# EAGLE design max7219-dotmatrix (EAGLE 6.1)
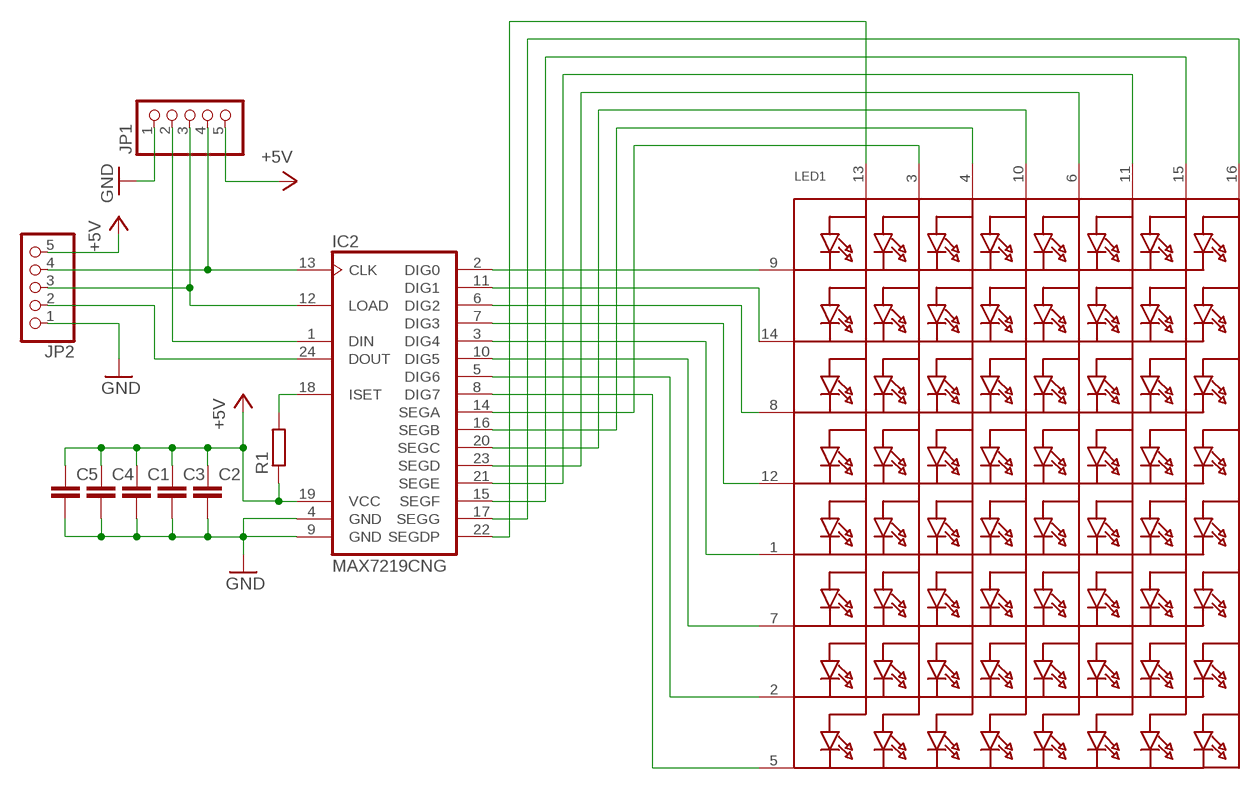
[diagram p0: schematic, sheet 1]

## Parts
C1  C-EUC0805K  [C0805K]
C2  C-EUC0805K  [C0805K]
C3  C-EUC0805K  [C0805K]
C4  C-EUC0805K  [C0805K]
C5  C-EUC0805K  [C0805K]
IC2  MAX7219CNG  [DIL24-3]
JP1  PINHD-1X5/90  [1X05/90]
JP2  PINHD-1X5/90  [1X05/90]
LED1  SEGMENT_8X8_ROWCATHODEM12A881UR  [SEGMENT_BL-M12A881UR]
R1  R-EU_M0805  [M0805]

## Nets
+5V: C1.1 C2.1 C3.1 C4.1 C5.1 IC2.19(VCC) JP1.5 JP2.5 R1.1
GND: C1.2 C2.2 C3.2 C4.2 C5.2 IC2.4(GND) IC2.9(GND) JP1.1 JP2.1
N$17: IC2.2(DIG0) LED1.9(K1)
N$18: IC2.11(DIG1) LED1.14(K2)
N$19: IC2.6(DIG2) LED1.8(K3)
N$20: IC2.7(DIG3) LED1.12(K4)
N$21: IC2.3(DIG4) LED1.1(K5)
N$22: IC2.10(DIG5) LED1.7(K6)
N$23: IC2.5(DIG6) LED1.2(K7)
N$24: IC2.8(DIG7) LED1.5(K8)
N$25: IC2.14(SEGA) LED1.3(A2)
N$26: IC2.16(SEGB) LED1.4(A3)
N$27: IC2.20(SEGC) LED1.10(A4)
N$28: IC2.23(SEGD) LED1.6(A5)
N$29: IC2.21(SEGE) LED1.11(A6)
N$30: IC2.15(SEGF) LED1.15(A7)
N$31: IC2.17(SEGG) LED1.16(A8)
N$32: IC2.22(SEGDP) LED1.13(A1)
N$33: IC2.24(DOUT) JP2.2
N$36: IC2.13(CLK) JP1.4 JP2.4
N$37: IC2.12(LOAD) JP1.3 JP2.3
N$40: IC2.18(ISET) R1.2
N$42: IC2.1(DIN) JP1.2

## Library data of the parts
C1-C5 = rcl:C-EU: CAPACITOR, European symbol
IC2 = maxim:MAX7219CNG: LED DISPLAY DRIVER; MF: MAXIM; MPN: MAX7219CNG; OC_FARNELL: 1523914; OC_NEWARK: 34C4018
JP1 JP2 = pinhead:PINHD-1X5: PIN HEADER
LED1 = adafruit:SEGMENT_8X8_ROWCATHODE: 8x8 LED Segment Displays: Row = Cathode 0.7" Red 8X8 Matrix, 1.9mm Round LEDs - BL-M07C881UR 1.2" Red 8x8 Matrix, 3.0mm Round LEDs - BL-M12A881UR 1.2" Red 8x8 Matrix, 3.0mm Square LEDs - BL-M12A883
R1 = rcl:R-EU_: RESISTOR, European symbol

## Board
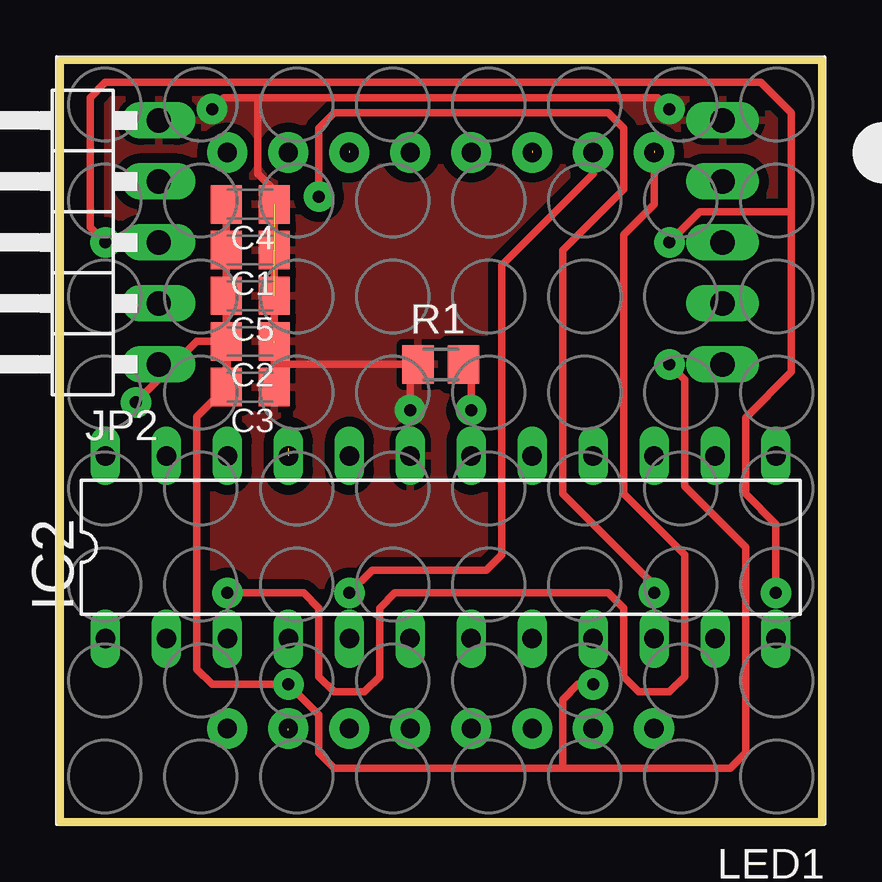
[diagram p1: board, top side]
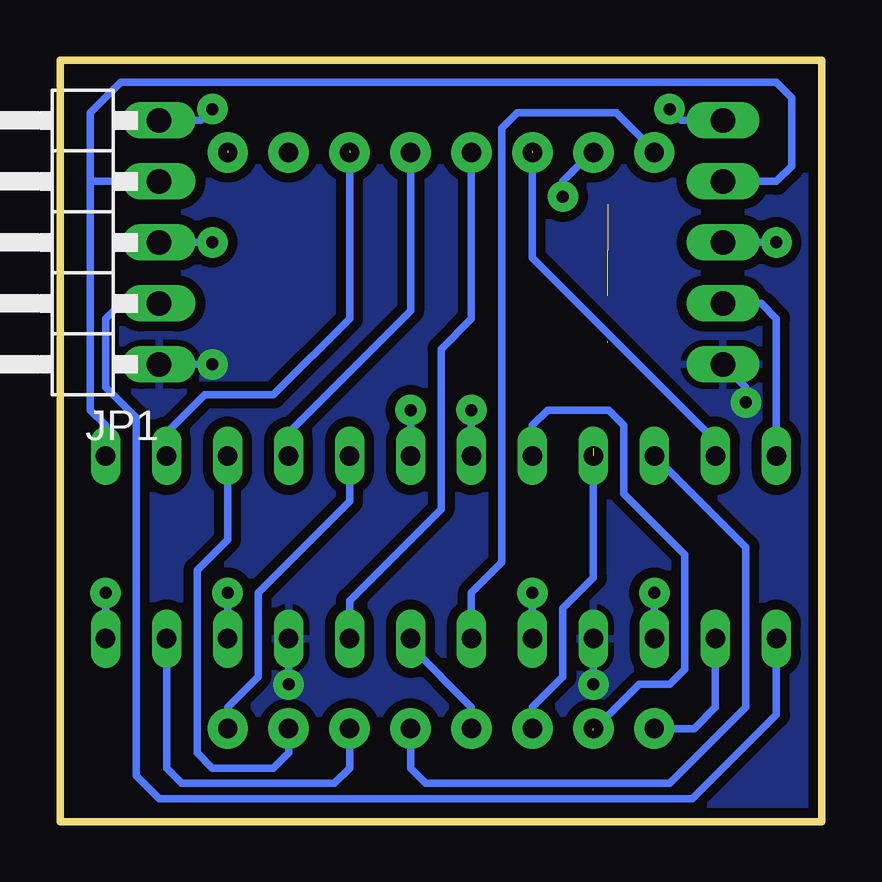
[diagram p2: board, bottom side, seen from below]

Size 31.74 x 31.73 mm. Coordinates in mm from the lower left corner, seen from the top.
Outline: 31.74,0 31.74,31.73 0,31.73 0,0 31.74,0
Copper layers (1*16): Top 0.0356mm / dielectric 1.5011mm / Bottom 0.0356mm
Design rules: minimum track width 6mil, minimum drill 13mil, track to track 6mil, track to pad 6mil, pad to pad 6mil, via to via 6mil, smd to smd 6mil, copper to edge 15mil, drill to drill 6mil, minimum pad ring 7mil, minimum via ring 7mil, stop-mask expansion 3mil, vias tented up to drill 0mil, thermal gap 10mil

### Footprints (pad centres in the part's own frame; a part is rotated, then mirrored left to right if it is on the bottom)
C0805K = smd 1.3 x 1.6: 1 -1,0; 2 1,0
DIL24-3 = drill 0.813 long: 1 -13.97,-3.81; 2 -11.43,-3.81; 3 -8.89,-3.81; 4 -6.35,-3.81; 5 -3.81,-3.81; 6 -1.27,-3.81; 7 1.27,-3.81; 8 3.81,-3.81; 9 6.35,-3.81; 10 8.89,-3.81; 11 11.43,-3.81; 12 13.97,-3.81; 13 13.97,3.81; 14 11.43,3.81; 15 8.89,3.81; 16 6.35,3.81; 17 3.81,3.81; 18 1.27,3.81; 19 -1.27,3.81; 20 -3.81,3.81; 21 -6.35,3.81; 22 -8.89,3.81; 23 -11.43,3.81; 24 -13.97,3.81
1X05/90 = drill 1.016 long: 1 -5.08,-3.81; 2 -2.54,-3.81; 3 0,-3.81; 4 2.54,-3.81; 5 5.08,-3.81
SEGMENT_BL-M12A881UR = drill 0.8 pad 1.676: 1 -8.89,-12; 2 -6.35,-12; 3 -3.81,-12; 4 -1.27,-12; 5 1.27,-12; 6 3.81,-12; 7 6.35,-12; 8 8.89,-12; 9 8.89,12; 10 6.35,12; 11 3.81,12; 12 1.27,12; 13 -1.27,12; 14 -3.81,12; 15 -6.35,12; 16 -8.89,12
M0805 = smd 1.3 x 1.6: 1 -0.95,0; 2 0.95,0

### Placement (x,y rotation side)
C1  7.92,23.81 180 top
C2  7.92,20 180 top
C3  7.92,18.1 180 top
C4  7.92,25.72 180 top
C5  7.92,21.91 180 top
IC2  15.86,11.43 0 top
JP1  31.42,24.13 90 bottom
JP2  0.3,24.13 90 top
LED1  15.86,15.88 180 top
R1  15.86,19.05 0 top

### Tracks (layer width: path | path; a pad name or v marks a point on that pad's centre or on a via)
+5V  (via drill 0.5 pad 1.27)  (3 unrouted)
  Top 0.305: 8.24,30.16 8.24,26.99 8.92,26.3 C4.1 C2.1 | 8.24,30.16 6.81,30.16 v6.34,29.69 | C3.1 8.92,19.05 | 8.92,19.05 8.92,19.95 8.88,20 | 14.59,19.05 8.92,19.05 | R1.1 14.59,19.05 | 14.59,19.05 v14.59,17.14 | 8.24,30.16 24.91,30.16 v25.39,29.69
  Bottom 0.305: v6.34,29.69 5.86,29.21 JP2.5 | v14.59,17.14 IC2.19 | v25.39,29.69 25.86,29.21 JP1.5
  pour Top (isolate 0.406): -0.01,31.75 31.74,31.75 31.74,-3.97 -0.01,-3.81
GND  (via drill 0.5 pad 1.27)
  Top 0.305: 20.94,2.22 27.93,2.22 28.56,2.86 28.56,11.43 26.02,13.97 26.02,18.41 v25.39,19.05 | C4.2 C1.2 | C2.2 C5.2 C1.2 | C2.2 6.97,20 6.97,18.1 | C1.2 C3.2 5.7,16.88 5.7,6.35 6.34,5.71 v9.51,5.71 10.78,4.45 10.78,2.86 11.42,2.22 20.94,2.22 | v3.16,17.46 5.7,20 C2.2 | v22.21,5.71 21.58,5.71 20.94,5.08 20.94,2.22
  Bottom 0.305: v3.16,17.46 3.16,18.1 JP2.1 | v22.21,5.71 IC2.9 | v25.39,19.05 JP1.1 | IC2.4 v9.51,5.71
  pour Bottom (isolate 0.406): -0.01,-6.99 -0.01,31.75 31.74,31.75 31.74,-6.99
N$17
  Bottom 0.305: LED1.9 5.32,3.88 4.43,4.76 IC2.2
N$18
  Bottom 0.305: LED1.14 19.67,2.22 20.31,1.59 26.66,1.59 27.29,2.22 IC2.11
N$19
  Bottom 0.305: IC2.6 14.59,9.53 13.32,10.79 13.32,28.89 12.69,29.53 8.56,29.53 6.97,27.94 LED1.8
N$20
  Bottom 0.305: LED1.12 14.59,4.76 17.13,7.3 IC2.7
N$21  (via drill 0.5 pad 1.27)  (1 unrouted)
  Top 0.305: 24.75,27.94 24.75,25.72 23.48,24.45 23.48,13.65 26.02,11.11 26.02,6.03 25.39,5.4 24.12,5.4 23.48,6.03 23.48,8.89 22.85,9.53 13.96,9.53 13.32,8.89 13.32,6.03 12.69,5.4 11.42,5.4 10.78,6.03 10.78,8.89 10.15,9.53 v6.97,9.53
  Bottom 0.305: v6.97,9.53 IC2.3
N$22  (via drill 0.5 pad 1.27)
  Top 0.305: v24.75,9.53 24.75,9.84 20.94,13.65 20.94,23.81 23.48,26.35 23.48,28.89 22.85,29.53 11.42,29.53 10.78,28.89 v10.78,26.04
  Bottom 0.305: v24.75,9.53 IC2.10 | v10.78,26.04 10.78,26.67 9.51,27.94 LED1.7
N$23  (via drill 0.5 pad 1.27)
  Top 0.305: LED1.2 22.21,26.99 18.4,23.18 18.4,11.11 17.77,10.48 13.01,10.48 v12.05,9.53
  Bottom 0.305: v12.05,9.53 IC2.5
N$24
  Bottom 0.305: LED1.5 14.59,20.95 15.86,19.68 15.86,13.02 19.67,9.21 IC2.8
N$25  (1 unrouted)
  Bottom 0.305: IC2.14 27.29,16.19 25.7,17.78 22.85,17.78 19.67,20.95 19.67,27.94
N$26
  Bottom 0.305: LED1.4 17.13,21.27 22.21,16.19 IC2.16
N$27  (1 unrouted)
  Bottom 0.305: IC2.20 12.05,16.51 11.42,17.14 8.88,17.14 8.24,16.51 8.24,13.65 5.7,11.11 5.7,6.35 6.34,5.71 7.61,5.71 9.51,3.81
N$28  (1 unrouted)
  Bottom 0.305: IC2.23 4.43,15.88 12.05,23.5 12.05,27.94
N$29  (1 unrouted)
  Bottom 0.305: LED1.11 12.05,4.76 10.78,6.03 10.78,8.89 9.51,10.16 9.51,15.56
N$30
  Bottom 0.305: LED1.15 22.21,2.86 22.85,2.22 25.39,2.22 26.02,2.86 26.02,10.48 24.75,11.75 IC2.15
N$31
  Bottom 0.305: LED1.16 24.75,4.76 23.48,6.03 23.48,9.53 19.67,13.34 IC2.17
N$32
  Bottom 0.305: LED1.13 17.13,2.22 16.5,1.59 6.34,1.59 3.16,4.76 3.16,11.43 IC2.22
N$33
  Bottom 0.305: IC2.24 1.89,20.95 2.53,21.59 JP2.2
N$36
  Bottom 0.305: JP1.4 30.47,26.67 | 30.47,26.67 30.47,29.53 29.2,30.8 1.89,30.8 1.26,30.16 1.26,27.3 1.89,26.67 JP2.4 | IC2.13 29.83,16.51 30.47,17.14 30.47,26.67
N$37  (via drill 0.5 pad 1.27)
  Top 0.305: 30.47,25.4 30.47,29.53 29.2,30.8 1.89,30.8 1.26,30.16 1.26,24.77 v1.89,24.13 | 30.47,25.4 30.47,18.73 28.56,16.83 28.56,13.65 29.83,12.38 v29.83,9.53 | v25.39,24.13 26.66,25.4 30.47,25.4
  Bottom 0.305: v1.89,24.13 JP2.3 | v29.83,9.53 IC2.12 | v25.39,24.13 JP1.3
N$40  (via drill 0.5 pad 1.27)
  Top 0.305: R1.2 17.13,19.05 v17.13,17.14
  Bottom 0.305: v17.13,17.14 IC2.18
N$42
  Bottom 0.305: IC2.1 1.89,4.45 5.38,0.95 27.61,0.95 28.56,1.91 28.56,16.83 29.83,18.1 29.83,20.95 29.2,21.59 JP1.2